# Altium schematic sheet 3.UART.SchDoc
size A2
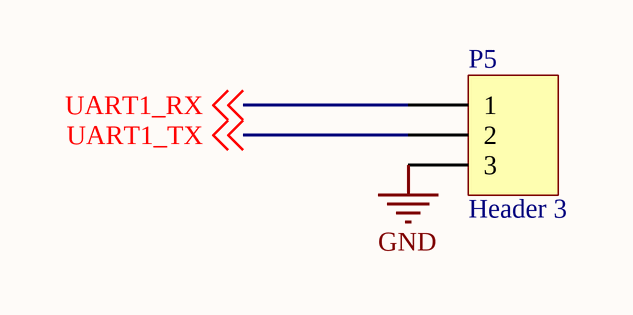
[diagram p0: 3.UART.SchDoc]

## Parts
P5  Header 3  [HDR1X3]

## Nets
GND: P5.3
UART1_RX: P5.1 ; off-sheet UART1_RX
UART1_TX: P5.2 ; off-sheet UART1_TX

## Library data of the parts
P5 = Header 3: Header, 3-Pin; LatestRevisionDate: 17-Jul-2002; LatestRevisionNote: Re-released for DXP Platform.; Publisher: Altium Limited